# EAGLE design Teensybasic4.0_verB(Exported) (EAGLE 9.3.0)
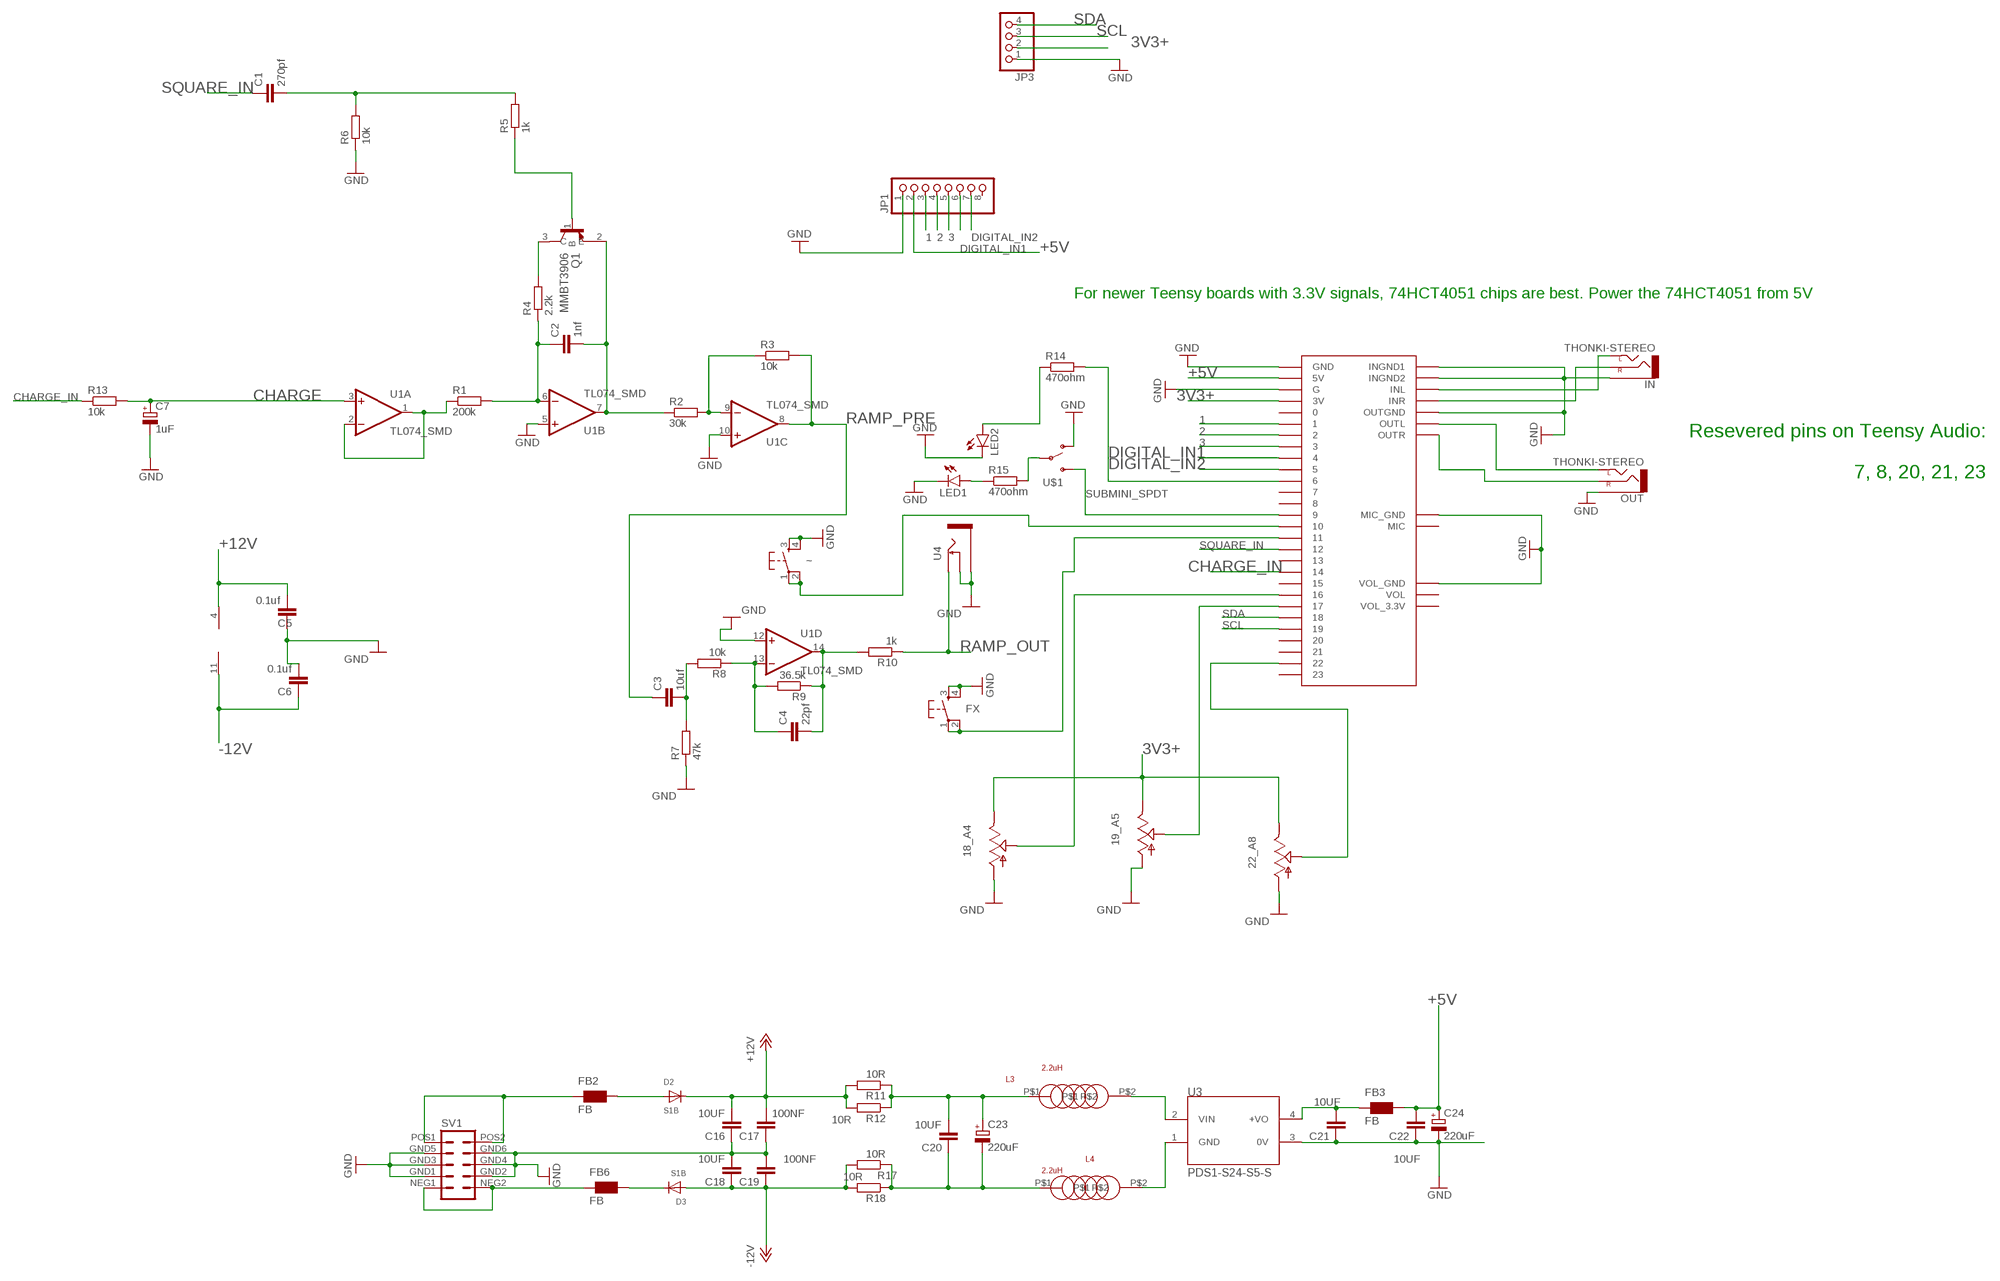
[diagram p0: schematic, sheet 1]

## Parts
18_A4  9MM_SNAP-IN_POT_  [9MM_SNAP-IN_POT]
19_A5  9MM_SNAP-IN_POT_  [9MM_SNAP-IN_POT]
22_A8  9MM_SNAP-IN_POT_  [9MM_SNAP-IN_POT]
C1  270pf  C-EUC0805  [C0805]
C2  1nf  C-EUC0805  [C0805]
C3  10uf  C-EUC0805  [C0805]
C4  22pf  C-EUC0805  [C0805]
C5  0.1uf  C-EUC0805  [C0805]
C6  0.1uf  C-EUC0805  [C0805]
C7  1uF  CPOL-EUE2.5-5  [E2,5-5]
C16  10UF  C-EUC0805  [C0805]
C17  100NF  C-EUC0603  [C0603]
C18  10UF  C-EUC0805  [C0805]
C19  100NF  C-EUC0603  [C0603]
C20  10UF  C-EUC0805  [C0805]
C21  10UF  C-EUC0805  [C0805]
C22  10UF  C-EUC0805  [C0805]
C23  220uF  CPOL-EUE2.5-7  [E2,5-7]
C24  220uF  CPOL-EUE2.5-7  [E2,5-7]
D2  S1B  [SMADIODE]
D3  S1B  [SMADIODE]
FB2  FB  FERRITE_BEAD_0603  [WUERTH-ELEKTRONIK_0603]
FB3  FB  FERRITE_BEAD_0603  [WUERTH-ELEKTRONIK_0603]
FB6  FB  FERRITE_BEAD_0603  [WUERTH-ELEKTRONIK_0603]
FX  DTSM-6  [DTSM-6]
IN  THONKI-STEREO  [WQP-PJ366ST_JACK]
JP1  PINHD-1X8  [1X08]
JP3  PINHD-1X4  [1X04]
L3  2.2uH  3015_INDUCTOR  [3015_INDUCTOR]
L4  2.2uH  3015_INDUCTOR  [3015_INDUCTOR]
LED1  LED3MM  [LED3MM]
LED2  LED3MM  [LED3MM]
OUT  THONKI-STEREO  [WQP-PJ366ST_JACK]
Q1  MMBT3906  [SOT95P240X120-3N]
R1  200k  R-EU_R0805  [R0805]
R2  30k  R-EU_R0805  [R0805]
R3  10k  R-EU_R0805  [R0805]
R4  2.2k  R-EU_R0805  [R0805]
R5  1k  R-EU_R0805  [R0805]
R6  10k  R-EU_R0805  [R0805]
R7  47k  R-EU_R0805  [R0805]
R8  10k  R-EU_R0805  [R0805]
R9  36.5k  R-EU_R0805  [R0805]
R10  1k  R-EU_R0805  [R0805]
R11  10R  R-EU_R0603  [R0603]
R12  10R  R-EU_R0603  [R0603]
R13  10k  R-EU_R0805  [R0805]
R14  470ohm  R-EU_R0805  [R0805]
R15  470ohm  R-EU_R0805  [R0805]
R17  10R  R-EU_R0603  [R0603]
R18  10R  R-EU_R0603  [R0603]
SV1  EURO_POWER_HEADERLOCK_PADS  [EURO_PWR_HEADER_LOCK]
U1  TL074_SMD  [SO14]
U3  PDS1-S24-S5-S  [CONV_PDS1-S24-S5-S]
U4  THONKICONNNEW  [WQP-PJ301M-12_JACK]
U$1  SUBMINI_SPDT  [SUBMINI_TOGGLE]
U$2  AUDIOSHIELD  [AUDIOSHIELD]
~  DTSM-6  [DTSM-6]

## Nets
1: JP1.3 U$2.1
2: JP1.4 U$2.2
3: JP1.5 U$2.3
3V3+: 18_A4.3(E) 19_A5.3(E) 22_A8.3(E) JP3.2 U$2.3V
+5V: C22.2 C24.+ FB3.2 JP1.2 U$2.5V
+12V: C5.2 C16.2 C17.2 D2.C R11.2 R12.2 U1.4(P:V+)
-12V: C6.1 C18.1 C19.1 D3.A R17.2 R18.2 U1.11(P:V-)
CHARGE: C7.+ R13.2 U1.3(A:+IN)
CHARGE_IN: R13.1 U$2.14
DIGITAL_IN1: JP1.6 U$2.4
DIGITAL_IN2: JP1.7 U$2.5
GND: 18_A4.1(A) 19_A5.1(A) 22_A8.1(A) C5.1 C6.2 C7.- C16.1 C17.1 C18.2 C19.2 C21.1 C22.1 C24.- FX.3 FX.4 IN.P$3_SLEEVE(SLEEVE) JP1.1 JP3.1 LED1.K(C) LED2.K(C) OUT.P$3_SLEEVE(SLEEVE) R6.1 R7.1 SV1.GND1 SV1.GND2 SV1.GND3 SV1.GND4 SV1.GND5 SV1.GND6 U1.5(B:+IN) U1.10(C:+IN) U1.12(D:+IN) U3.3(0V) U4.P$2_SWITCH(SWITCH) U4.P$3_SLEEVE(SLEEVE) U$1.1(O) U$2.G U$2.GND U$2.GND_MIC(MIC_GND) U$2.INGND1 U$2.INGND2 U$2.OUTGND U$2.VOL_GND ~.3 ~.4
N$1: R1.1 U1.1(A:OUT) U1.2(A:-IN)
N$2: Q1.3(C) R4.2
N$3: C4.1 R8.1 R9.2 U1.13(D:-IN)
N$4: C2.1 R1.2 R4.1 U1.6(B:-IN)
N$5: C2.2 Q1.2(E) R2.1 U1.7(B:OUT)
N$6: Q1.1(B) R5.1
N$7: C1.2 R5.2 R6.2
N$8: C4.2 R9.1 R10.2 U1.14(D:OUT)
N$9: R2.2 R3.1 U1.9(C:-IN)
N$10: C3.2 R7.2 R8.2
N$11: U$1.3(S) U$2.9
N$12: IN.P$1_TIP(LEFT) U$2.INL
N$13: R15.2 U$1.COM(COMMON)
N$14: LED1.A R15.1
N$15: U$2.10 ~.1 ~.2
N$17: FX.1 FX.2 U$2.11
N$18: IN.P$2_SWITCH(RIGHT) U$2.INR
N$19: OUT.P$1_TIP(LEFT) U$2.OUTL
N$23: OUT.P$2_SWITCH(RIGHT) U$2.OUTR
N$24: LED2.A R14.1
N$25: 19_A5.2(S) U$2.17
N$27: 18_A4.2(S) U$2.16
N$29: 22_A8.2(S) U$2.22
N$30: R14.2 U$2.6
N$35: FB6.1 SV1.NEG1 SV1.NEG2
N$36: FB2.1 SV1.POS1 SV1.POS2
N$37: C20.2 C23.+ L3.P$1 R11.1 R12.1
N$38: C20.1 C23.- L4.P$1 R17.1 R18.1
N$39: C21.2 FB3.1 U3.4(+VO)
N$40: L3.P$2 U3.2(VIN)
N$41: L4.P$2 U3.1(GND)
N$42: D2.A FB2.2
N$43: D3.C FB6.2
RAMP_OUT: R10.1 U4.P$1_TIP(TIP)
RAMP_PRE: C3.1 R3.2 U1.8(C:OUT)
SCL: JP3.3 U$2.19
SDA: JP3.4 U$2.18
SQUARE_IN: C1.1 U$2.12
Unconnected: JP1.8 U$2.0 U$2.7 U$2.8 U$2.13 U$2.15 U$2.20 U$2.21 U$2.23 U$2.MIC U$2.VOL U$2.VOL_3.3V

## Notes on the sheet
- For newer Teensy boards with 3.3V signals, 74HCT4051 chips are best. Power the 74HCT4051 from 5V
- Resevered pins on Teensy Audio:
  
  7, 8, 20, 21, 23

## Library data of the parts
18_A4 19_A5 22_A8 = MusicThingModular:9MM_SNAP-IN_POT: 9mm vertical snap-in pot, Alpha / Panasonic style
C1-C6 C16-C22 = rcl:C-EU: CAPACITOR, European symbol; SPICEPREFIX: C
C7 C23 C24 = rcl:CPOL-EU: POLARIZED CAPACITOR, European symbol; SPICEPREFIX: C
D2 D3 = Electrosmith-Semiconductors:S1B; BIN#: 12-006; IPN: S1B; MPN: S1B; PACKAGE: SMA
FB2 FB3 FB6 = Electrosmith-Passives:FERRITE_BEAD: SMD EMI Suppression Ferrite Beads - excellent anti-EMI properties - low DCR - impedances till 3000 ohms - rated current up to 6 A; BIN#: 8-047; IPN: FB R0603; MPN: MI0603J601R-10; PACKAGE: R0603
FX ~ = switch-tact:DTSM-6
IN OUT = MusicThingModular:THONKI-STEREO: 3.5mm socket for Eurorack modular synths
JP1 = pinhead:PINHD-1X8: PIN HEADER
JP3 = pinhead:PINHD-1X4: PIN HEADER
L3 L4 = MusicThingModular:3015_INDUCTOR
LED1 LED2 = led:LED: LED OSRAM: - CHIPLED LG R971, LG N971, LY N971, LG Q971, LY Q971, LO R971, LY R971 LH N974, LH R974 LS Q976, LO Q976, LY Q976 LO Q996 - Hyper CHIPLED LW Q18S LB Q993, LB Q99A, LB R99A - SideLED LS A670, LO A670, LY A670, LG A670, LP A670 LB A673, LV A673, LT A673, LW A673 LH A674 LY A675 LS A676, LA A676, LO A676, LY A676, LW A676 LS A679, LY A679, LG A679 - Hyper Micro SIDELED® LS Y876, LA Y876, LO Y876, LY Y876 LT Y87S - SmartLED LW L88C, LW L88S LB L89C, LB L89S, LG L890 LS L89K, LO L89K, LY L89K LS L896, LA L896, LO L896, LY L896 - TOPLED LS T670, LO T670, LY T670, LG T670, LP T670 LSG T670, LSP T670, LSY T670, LOP T670, LYG T670 LG T671, LOG T671, LSG T671 LB T673, LV T673, LT T673, LW T673 LH T674 LS T676, LA T676, LO T676, LY T676, LB T676, LH T676, LSB T676, LW T676 LB T67C, LV T67C, LT T67C, LS T67K, LO T67K, LY T67K, LW E67C LS E67B, LA E67B, LO E67B, LY E67B, LB E67C, LV E67C, LT E67C LW T67C LS T679, LY T679, LG T679 LS T770, LO T770, LY T770, LG T770, LP T770 LB T773, LV T773, LT T773, LW T773 LH T774 LS E675, LA E675, LY E675, LS T675 LS T776, LA T776, LO T776, LY T776, LB T776 LHGB T686 LT T68C, LB T68C - Hyper Mini TOPLED® LB M676 - Mini TOPLED Santana® LG M470 LS M47K, LO M47K, LY M47K Source: http://www.osram.convergy.de LUXEON: - LUMILED® LXK2-PW12-R00, LXK2-PW12-S00, LXK2-PW14-U00, LXK2-PW14-V00 LXK2-PM12-R00, LXK2-PM12-S00, LXK2-PM14-U00 LXK2-PE12-Q00, LXK2-PE12-R00, LXK2-PE12-S00, LXK2-PE14-T00, LXK2-PE14-U00 LXK2-PB12-K00, LXK2-PB12-L00, LXK2-PB12-M00, LXK2-PB14-N00, LXK2-PB14-P00, LXK2-PB14-Q00 LXK2-PR12-L00, LXK2-PR12-M00, LXK2-PR14-Q00, LXK2-PR14-R00 LXK2-PD12-Q00, LXK2-PD12-R00, LXK2-PD12-S00 LXK2-PH12-R00, LXK2-PH12-S00 LXK2-PL12-P00, LXK2-PL12-Q00, LXK2-PL12-R00 Source: www.luxeon.com KINGBRIGHT: KA-3528ASYC Source: www.kingbright.com
Q1 = MMBT3906:MMBT3906: MMBT3906 Series 40 V CE Breakdown 0.2 A PNP General Purpose Amplifier - SOT-23 Check prices <https://pricing.snapeda.com/parts/MMBT3906/STMicroelectronics/view-part?ref=eda>; AVAILABILITY: Good; DESCRIPTION: Bipolar (BJT) Transistor PNP 40V 200mA 250MHz 300mW Surface Mount SOT-23-3; MF: STMicroelectronics; MP: MMBT3906; PACKAGE: SOT-23 NTE Electronics; PRICE: None; PURCHASE-URL: https://pricing.snapeda.com/search/part/MMBT3906/?ref=eda
R1-R15 R17 R18 = rcl:R-EU_: RESISTOR, European symbol; SPICEPREFIX: R
SV1 = MusicThingModular:EURO_POWER_HEADER: Power Header 10 pin power header for Eurorack Power Supplies Variants with fatter pads for easier soldering, and the LOCK variant which has 5mil offset pins to hold the component in place before soldering
U1 = MusicThingModular:TL074: Generic Quad Op Amp
U3 = PDS1-S24-S5-S:PDS1-S24-S5-S: 12 Vdc, 0.083 A, 1 W, 10.8~13.2 Vdc Input Range; AVAILABILITY: Good; DESCRIPTION: PDS1 Series 1 W 12 VDC 83 mA Single Output DC-DC Isolated Converter; MF: CUI; MP: PDS1-S12-S12-S; PACKAGE: SIP-4 CUI; PRICE: 3.90 USD
U4 = MusicThingModular:THONKICONN: 3.5mm socket for Eurorack modular synths
U$1 = MusicThingModular:SUBMINI_SPDT
U$2 = Teensy_Audioshield:AUDIOSHIELD: Teensy 3 Audioshield by PJRC.COM

## Board
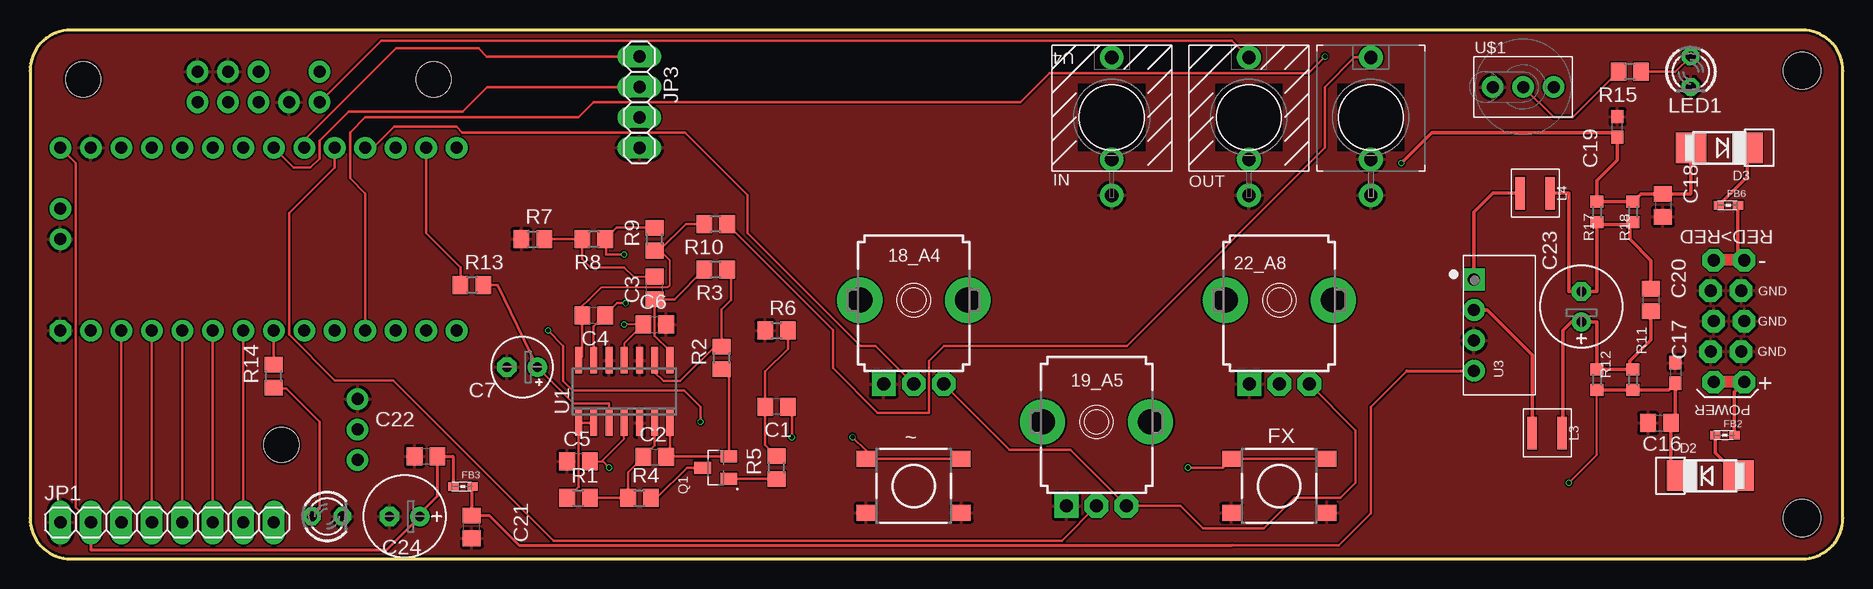
[diagram p1: board, top side]
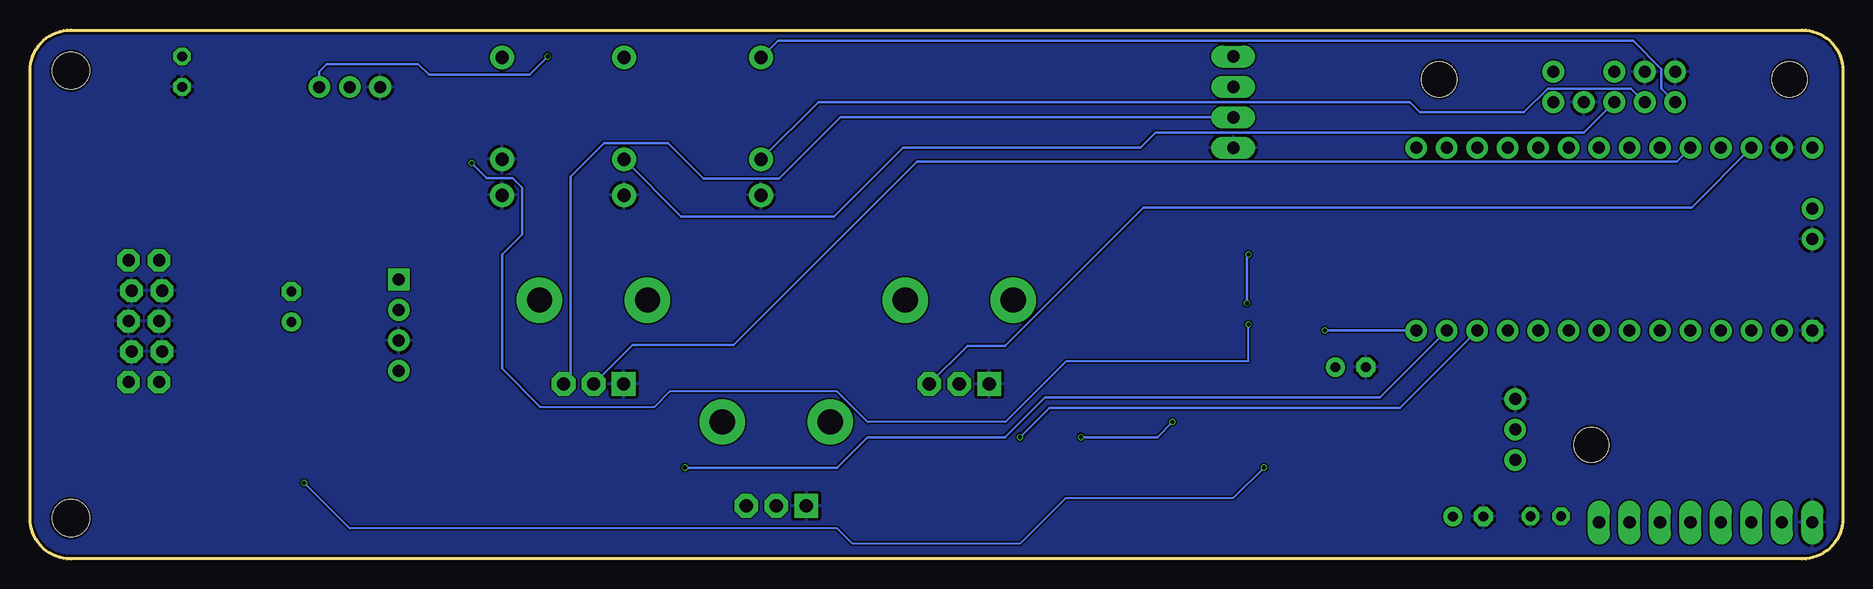
[diagram p2: board, bottom side, seen from below]

Size 151.11 x 44.12 mm. Coordinates in mm from the lower left corner, seen from the top.
Outline: 147.71,0 arc90 151.11,3.4 151.11,40.72 arc90 147.71,44.12 3.4,44.12 arc90 0,40.72 0,3.4 arc90 3.4,0 147.71,0
Copper layers (1*16): Top 0.035mm / dielectric 1.6mm / Bottom 0.035mm
Design rules "jlcpcb-2layers": minimum track width 5mil, minimum drill 0.3mm, track to track 5mil, track to pad 5mil, pad to pad 5mil, via to via 5mil, smd to smd 5mil, copper to edge 0.2mm, drill to drill 6mil, minimum pad ring 10mil, minimum via ring 3mil, stop-mask expansion 4mil, vias tented up to drill 0mil, thermal gap 10mil
Holes 3.1 mm at 147.71,40.72 147.71,3.4

### Footprints (pad centres in the part's own frame; a part is rotated, then mirrored left to right if it is on the bottom)
9MM_SNAP-IN_POT = drill 1.1 square: 1 -2.5,-7 | drill 1.1 octagon: 2 0,-7; 3 2.5,-7 | drill 2.1 pad 2.794: CHASSIS1 -4.5,0; CHASSIS2 4.5,0
C0805 = smd 1.3 x 1.5: 1 -0.95,0; 2 0.95,0
E2,5-5 = drill 0.813 pad 1.6: + -1.27,0 | drill 0.813 pad 1.6 octagon: - 1.27,0
C0603 = smd 1.1 x 1: 1 -0.85,0; 2 0.85,0
E2,5-7 = drill 0.813 pad 1.6: + -1.27,0 | drill 0.813 pad 1.6 octagon: - 1.27,0
SMADIODE = smd 2.54 x 2.54: A 2.349,0; C -2.349,0
WUERTH-ELEKTRONIK_0603 = smd 0.85 x 0.7: 1 -0.9,0; 2 0.7,0
DTSM-6 = smd 1.55 x 1.3: 1 -3.975,2.25; 2 3.975,2.25; 3 -3.975,-2.25; 4 3.975,-2.25
WQP-PJ366ST_JACK = drill 1.1: P$1_TIP 0,5; P$2_SWITCH 0,-3.5; P$3_SLEEVE 0,-6.5
1X08 = drill 1.016 long: 1 -8.89,0; 2 -6.35,0; 3 -3.81,0; 4 -1.27,0; 5 1.27,0; 6 3.81,0; 7 6.35,0; 8 8.89,0
1X04 = drill 1.016 long: 1 -3.81,0; 2 -1.27,0; 3 1.27,0; 4 3.81,0
3015_INDUCTOR = smd 0.8 x 2.7: P$1 -1.25,0; P$2 1.25,0
LED3MM = drill 0.813 octagon: A -1.27,0; K 1.27,0
SOT95P240X120-3N = smd 1 x 1.4: 1 -0.95,-1.1; 2 0.95,-1.1; 3 0,1.1
R0805 = smd 1.3 x 1.5: 1 -0.95,0; 2 0.95,0
R0603 = smd 1 x 1.1: 1 -0.85,0; 2 0.85,0
EURO_PWR_HEADER_LOCK = drill 1.016 pad 1.88 octagon: GND1 -2.54,1.143; GND2 -2.54,-1.397; GND3 0,1.397; GND4 0,-1.143; GND5 2.54,1.143; GND6 2.54,-1.397; NEG1 -5.08,1.397; NEG2 -5.08,-1.143; POS1 5.08,1.397; POS2 5.08,-1.143
SO14 = smd 0.6 x 2.2: 1 -3.81,-2.6; 2 -2.54,-2.6; 3 -1.27,-2.6; 4 0,-2.6; 5 1.27,-2.6; 6 2.54,-2.6; 7 3.81,-2.6; 8 3.81,2.6; 9 2.54,2.6; 10 1.27,2.6; 11 0,2.6; 12 -1.27,2.6; 13 -2.54,2.6; 14 -3.81,2.6
CONV_PDS1-S24-S5-S = drill 1 square: 1 -3.81,-2.1 | drill 1: 2 -1.27,-2.1; 3 1.27,-2.1; 4 3.81,-2.1
WQP-PJ301M-12_JACK = drill 1.1: P$1_TIP 0,5; P$2_SWITCH 0,-3.5; P$3_SLEEVE 0,-6.5
SUBMINI_TOGGLE = drill 1 pad 1.422: 1 -2.54,0; 3 2.54,0; COM 0,0
AUDIOSHIELD = drill 1 pad 1.778: 0 -13.97,-5.08; 1 -11.43,-5.08; 2 -8.89,-5.08; 3 -6.35,-5.08; 3V -11.43,10.16; 4 -3.81,-5.08; 5 -1.27,-5.08; 5V -16.51,10.16; 6 1.27,-5.08; 7 3.81,-5.08; 8 6.35,-5.08; 9 8.89,-5.08; 10 11.43,-5.08; 11 13.97,-5.08; 12 16.51,-5.08; 13 16.51,10.16; 14 13.97,10.16; 15 11.43,10.16; 16 8.89,10.16; 17 6.35,10.16; 18 3.81,10.16; 19 1.27,10.16; 20 -1.27,10.16; 21 -3.81,10.16; 22 -6.35,10.16; 23 -8.89,10.16; G -13.97,10.16; GND_MIC -16.51,2.54; INGND1 -5.08,16.51; INGND2 -2.54,16.51; INL -5.08,13.97; INR -2.54,13.97; MIC -16.51,5.08; OUTGND 2.54,13.97; OUTL 5.08,13.97; OUTR 0,13.97; UNUSED1 0,16.51; UNUSED2 5.08,16.51; VOL 8.255,-13.335; VOL_3.3V 8.255,-15.875; VOL_GND 8.255,-10.795 | drill 1 pad 1.778 octagon: GND -16.51,-5.08 | hole 2.921: 1.905,-14.605; -14.605,15.875; 14.605,15.875

### Placement (x,y rotation side)
18_A4  73.66,21.59 0 top
19_A5  88.9,11.43 0 top
22_A8  104.14,21.59 0 top
C1  62.23,12.7 180 top
C2  52.07,8.51 0 top
C3  52.07,22.61 90 top
C4  46.99,20.32 180 top
C5  45.72,8.13 0 top
C6  52.07,19.56 0 top
C7  41.02,16 180 top
C16  135.83,11.35 0 top
C17  137.16,15.52 270 top
C18  136.12,29.5 270 top
C19  132.32,36.04 90 top
C20  135.12,21.6 270 top
C21  36.83,2.67 90 top
C22  33.01,8.58 0 top
C23  129.32,21.04 90 top
C24  31.23,3.54 180 top
D2  140.07,6.93 0 top
D3  140.81,34.29 180 top
FB2  141.18,10.31 180 top
FB3  35.98,6.04 180 top
FB6  141.47,29.5 180 top
FX  104.14,6.1 0 top
IN  90.17,36.83 0 top
JP1  11.43,3.05 0 top
JP3  50.8,38.1 90 top
L3  126.47,10.5 180 top
L4  125.47,30.5 180 top
LED1  138.43,40.64 270 top
LED2  24.77,3.56 0 top
OUT  101.6,36.83 0 top
Q1  57.15,7.62 90 top
R1  45.72,5.08 0 top
R2  57.66,16.76 90 top
R3  57.15,24.13 180 top
R4  50.8,5.08 0 top
R5  62.23,7.62 90 top
R6  62.23,19.05 0 top
R7  41.91,26.67 0 top
R8  46.99,26.67 180 top
R9  52.07,26.67 90 top
R10  57.15,27.94 180 top
R11  133.62,14.96 270 top
R12  130.62,14.96 270 top
R13  36.83,22.86 0 top
R14  20.32,15.24 90 top
R15  133.35,40.64 180 top
R17  130.62,28.96 90 top
R18  133.62,28.96 90 top
SV1  141.49,19.84 270 top
U1  49.53,13.97 0 top
U3  122.47,19.5 270 top
U4  111.76,36.83 0 top
U$1  124.46,39.37 0 top
U$2  19.05,24.13 0 top
~  73.66,6.1 0 top

### Tracks (layer width: path | path; a pad name or v marks a point on that pad's centre or on a via)
1
  Top 0.203: U$2.1 JP1.3
2
  Top 0.203: U$2.2 JP1.4
3
  Top 0.203: U$2.3 JP1.5
3V3+
  Top 0.203: 18_A4.3 81.65,9.1 86.73,9.1 19_A5.3 95.9,4.43 97.79,2.54 102.87,2.54 105.41,5.08 109.22,5.08 110.49,6.35 110.49,10.74 22_A8.3
  Bottom 0.203: U$2.3V 12.59,29.32 58.31,29.32 69.86,17.77 72.98,17.77 18_A4.3 | JP3.2 83.57,36.83 88.67,31.73 94.97,31.73 97.92,34.67 103.25,34.67 106.05,31.88 106.05,15.19 22_A8.3
+5V
  Top 0.203: U$2.5V 3.81,33.02 3.81,4.32 JP1.2
  Top 0.254: JP1.2 5.08,0.76 29.72,0.76 C24.+ 32.5,3.8 33.96,5.26 C22.2 35.23,8.58 35.28,8.52 FB3.2
+12V  (via drill 0.35)
  Top 0.152: U1.4 49.53,10.03 47.62,8.13 C5.2 47.75,8.13 v48.26,7.62 | v128.27,6.35 130.62,8.7 R12.2
  Top 0.305: D2.C 136.78,7.88 C16.2 137.16,11.73 C17.2 136.6,14.11 R11.2 R12.2
  Bottom 0.152: v128.27,6.35 124.46,2.54 83.82,2.54 82.55,1.27 68.58,1.27 64.77,5.08 50.8,5.08 v48.26,7.62
-12V  (via drill 0.35)
  Top 0.152: U1.11 49.53,17.97 C6.1 v49.53,19.56
  Top 0.305: v114.3,33.02 116.84,35.56 131.96,35.56 C19.1 132.32,33.26 130.62,31.56 R17.2 R18.2 134.26,30.45 C18.1 138.4,30.45 138.43,30.48 138.43,34.26 D3.A
  Bottom 0.152: 108.58,12.7 99.06,12.7 97.79,13.97 83.82,13.97 81.28,11.43 69.81,11.43 64.73,16.51 49.53,16.51 v49.53,19.56
  Bottom 0.203: 108.58,12.7 111.76,15.88 111.76,25.4 110.11,27.05 110.11,30.99 110.87,31.75 113.03,31.75 v114.3,33.02
CHARGE
  Top 0.203: U1.3 48.26,12.98 45.31,12.98 C7.+ 38.99,22.86 R13.2
CHARGE_IN
  Top 0.203: U$2.14 33.02,27.18 35.88,24.32 R13.1
DIGITAL_IN1
  Top 0.203: U$2.4 JP1.6
DIGITAL_IN2
  Top 0.203: U$2.5 JP1.7
GND
  pour Top: 0,44.45 151.13,44.45 151.13,0 0,0
  pour Bottom: 0,44.45 151.13,44.45 151.13,0 0,0
N$1
  Top 0.203: R1.1 45.72,6.03 U1.1 U1.2
N$2
  Top 0.203: Q1.3 54.78,7.62 52.24,5.08 R4.2
N$3  (via drill 0.35)
  Top 0.203: R9.2 48.89,27.62 R8.1 48.01,26.6 48.01,25.4 v49.53,25.4 | U1.13 46.99,19.37 C4.1 48.96,21.34 v49.66,21.34
  Bottom 0.203: v49.53,25.4 49.66,25.27 v49.66,21.34
N$4
  Top 0.203: R1.2 R4.1 49.85,7.24 C2.1 52.07,9.46 U1.6
N$5
  Top 0.203: U1.7 53.34,8.83 C2.2 53.08,8.57 Q1.2 58.25,15.22 R2.1
N$6
  Top 0.203: R5.1 Q1.1
N$7
  Top 0.203: R5.2 61.28,9.52 C1.2 61.28,15.62 63.18,17.52 R6.2
N$8
  Top 0.152: 46.55,21.59 47.63,22.68 53.16,22.68 53.34,22.86 53.34,24.89 52.51,25.72 R9.1
  Top 0.203: R9.1 52.45,25.72 54.67,27.94 R10.2 | U1.14 46.04,16.89 C4.2 46.04,21.08 46.55,21.59
N$9
  Top 0.203: U1.9 52.07,15.57 52.81,14.84 54.2,14.84 57.02,17.65 57.6,17.65 R2.2 57.66,20.83 58.42,21.59 58.42,23.81 R3.1
N$10
  Top 0.152: 49.53,24.32 50.29,23.56 C3.2
  Top 0.203: 49.53,24.32 46.74,24.32 46.04,25.02 R8.2 R7.2
N$11  (via drill 0.35)
  Top 0.203: U$2.9 27.94,30.48 26.67,31.75 26.67,35.56 27.94,36.83 45.72,36.83 46.99,38.1 82.55,38.1 84.96,40.51 106.55,40.51 v107.95,41.91
  Bottom 0.203: U$1.3 127,40.64 126.36,41.27 118.75,41.27 117.86,40.39 109.47,40.39 v107.95,41.91
N$12
  Bottom 0.203: IN.P$1_TIP 88.77,43.23 17.48,43.23 15.11,40.86 15.11,39.24 U$2.INL
N$13
  Top 0.203: R15.2 128.59,36.83 127,36.83 U$1.COM
N$14
  Top 0.203: R15.1 137.16,40.64 LED1.A
N$15  (via drill 0.35)
  Top 0.203: v68.58,10.16 69.69,9.05 ~.1 ~.2
  Bottom 0.203: U$2.10 36.94,12.59 66.15,12.59 v68.58,10.16
N$17  (via drill 0.35)
  Top 0.203: FX.2 FX.1 99.44,7.62 v96.52,7.62
  Bottom 0.203: U$2.11 38.58,13.49 66.52,13.49 69.85,10.16 81.28,10.16 83.82,7.62 v96.52,7.62
N$18
  Bottom 0.203: U$2.INR 17.65,39.24 24.6,39.24 26.57,37.27 35.25,37.27 36.07,38.1 85.4,38.1 IN.P$2_SWITCH
N$19
  Top 0.203: OUT.P$1_TIP 100.2,43.23 29.26,43.23 U$2.OUTL
N$23
  Bottom 0.203: U$2.OUTR 21.59,35.56 57.28,35.56 58.55,34.29 78.36,34.29 84.07,28.57 96.84,28.57 OUT.P$2_SWITCH
N$24
  Top 0.203: R14.1 20.39,14.22 21.34,14.22 24.13,11.43 24.13,4.19 LED2.A
N$25
  Top 0.203: 19_A5.2 86.01,1.54 43.63,1.54 30.27,14.89 25.4,14.89 21.59,18.7 21.59,28.83 25.4,32.64 U$2.17
N$27
  Top 0.203: U$2.16 28.61,34.29 30.36,36.04 35.55,36.04 36.03,35.56 54.61,35.56 59.82,30.35 59.82,27.18 69.22,17.78 70.47,17.78 18_A4.2
N$29
  Bottom 0.203: 22_A8.2 100.87,17.86 92.46,17.86 77.17,33.15 13.84,33.15 U$2.22
N$30
  Top 0.203: U$2.6 R14.2
N$35
  Top 0.305: SV1.NEG1 142.37,25.44 FB6.1
  Top 1.016: SV1.NEG1 SV1.NEG2
N$36
  Top 0.305: SV1.POS1 142.08,13.95 FB2.1
  Top 1.016: SV1.POS1 SV1.POS2
N$37
  Top 0.305: C20.2 135.12,18.28 133.35,16.51 133.35,16.07 R11.1 R12.1 130.62,19.77 C23.+ 128.49,19.77 127.76,19.05 127.76,10.54 L3.P$1
N$38
  Top 0.305: C20.1 135.12,24.9 133.35,26.67 133.35,27.84 133.4,27.89 | 133.4,27.89 R18.1 | L4.P$1 128.25,30.5 128.27,30.48 128.27,22.31 C23.- 130.62,22.31 R17.1 130.83,27.89 133.4,27.89
N$39
  Top 0.203: 100.22,1.16 109.11,1.16 111.76,3.81 111.76,12.7 114.75,15.69
  Top 0.254: FB3.1 36.83,5.98 C21.2 38.29,3.62 40.76,1.16 100.22,1.16 | 114.75,15.69 U3.4
N$40
  Top 0.305: L3.P$2 125.22,17.02 121.47,20.77 U3.2
N$41
  Top 0.305: U3.1 120.37,28.93 121.94,30.5 L4.P$2
N$42
  Top 0.305: D2.A 140.48,8.87 FB2.2
N$43
  Top 0.305: FB6.2 143.16,31.89 D3.C
RAMP_OUT
  Top 0.203: R10.1 66.93,19.11 66.93,15.92 70.66,12.19 74.93,12.19 74.93,16.51 76.2,17.78 91.44,17.78 107.95,34.29 107.95,39.37 110.41,41.83 U4.P$1_TIP
RAMP_PRE
  Top 0.203: U1.8 53.34,17.34 52.07,18.61 C3.1 53.73,21.66 R3.2
SCL
  Top 0.203: JP3.3 38.1,39.37 36.04,37.31 26.55,37.31 24.13,34.89 24.13,33.4 23.37,32.64 21.97,32.64 U$2.19
SDA
  Top 0.203: JP3.4 39.42,41.91 38.06,41.91 37.39,42.58 30.52,42.58 22.86,34.92 U$2.18
SQUARE_IN  (via drill 0.35)
  Top 0.203: v63.5,10.16 63.5,12.38 C1.1 | v55.88,11.43 55.88,12.7 54.51,14.07 45.24,14.07 44.45,14.86 44.45,17.78 v43.18,19.05
  Bottom 0.203: v55.88,11.43 57.15,10.16 v63.5,10.16 | U$2.12 v43.18,19.05